# Altium project camera_module_V1R1.PrjPcb
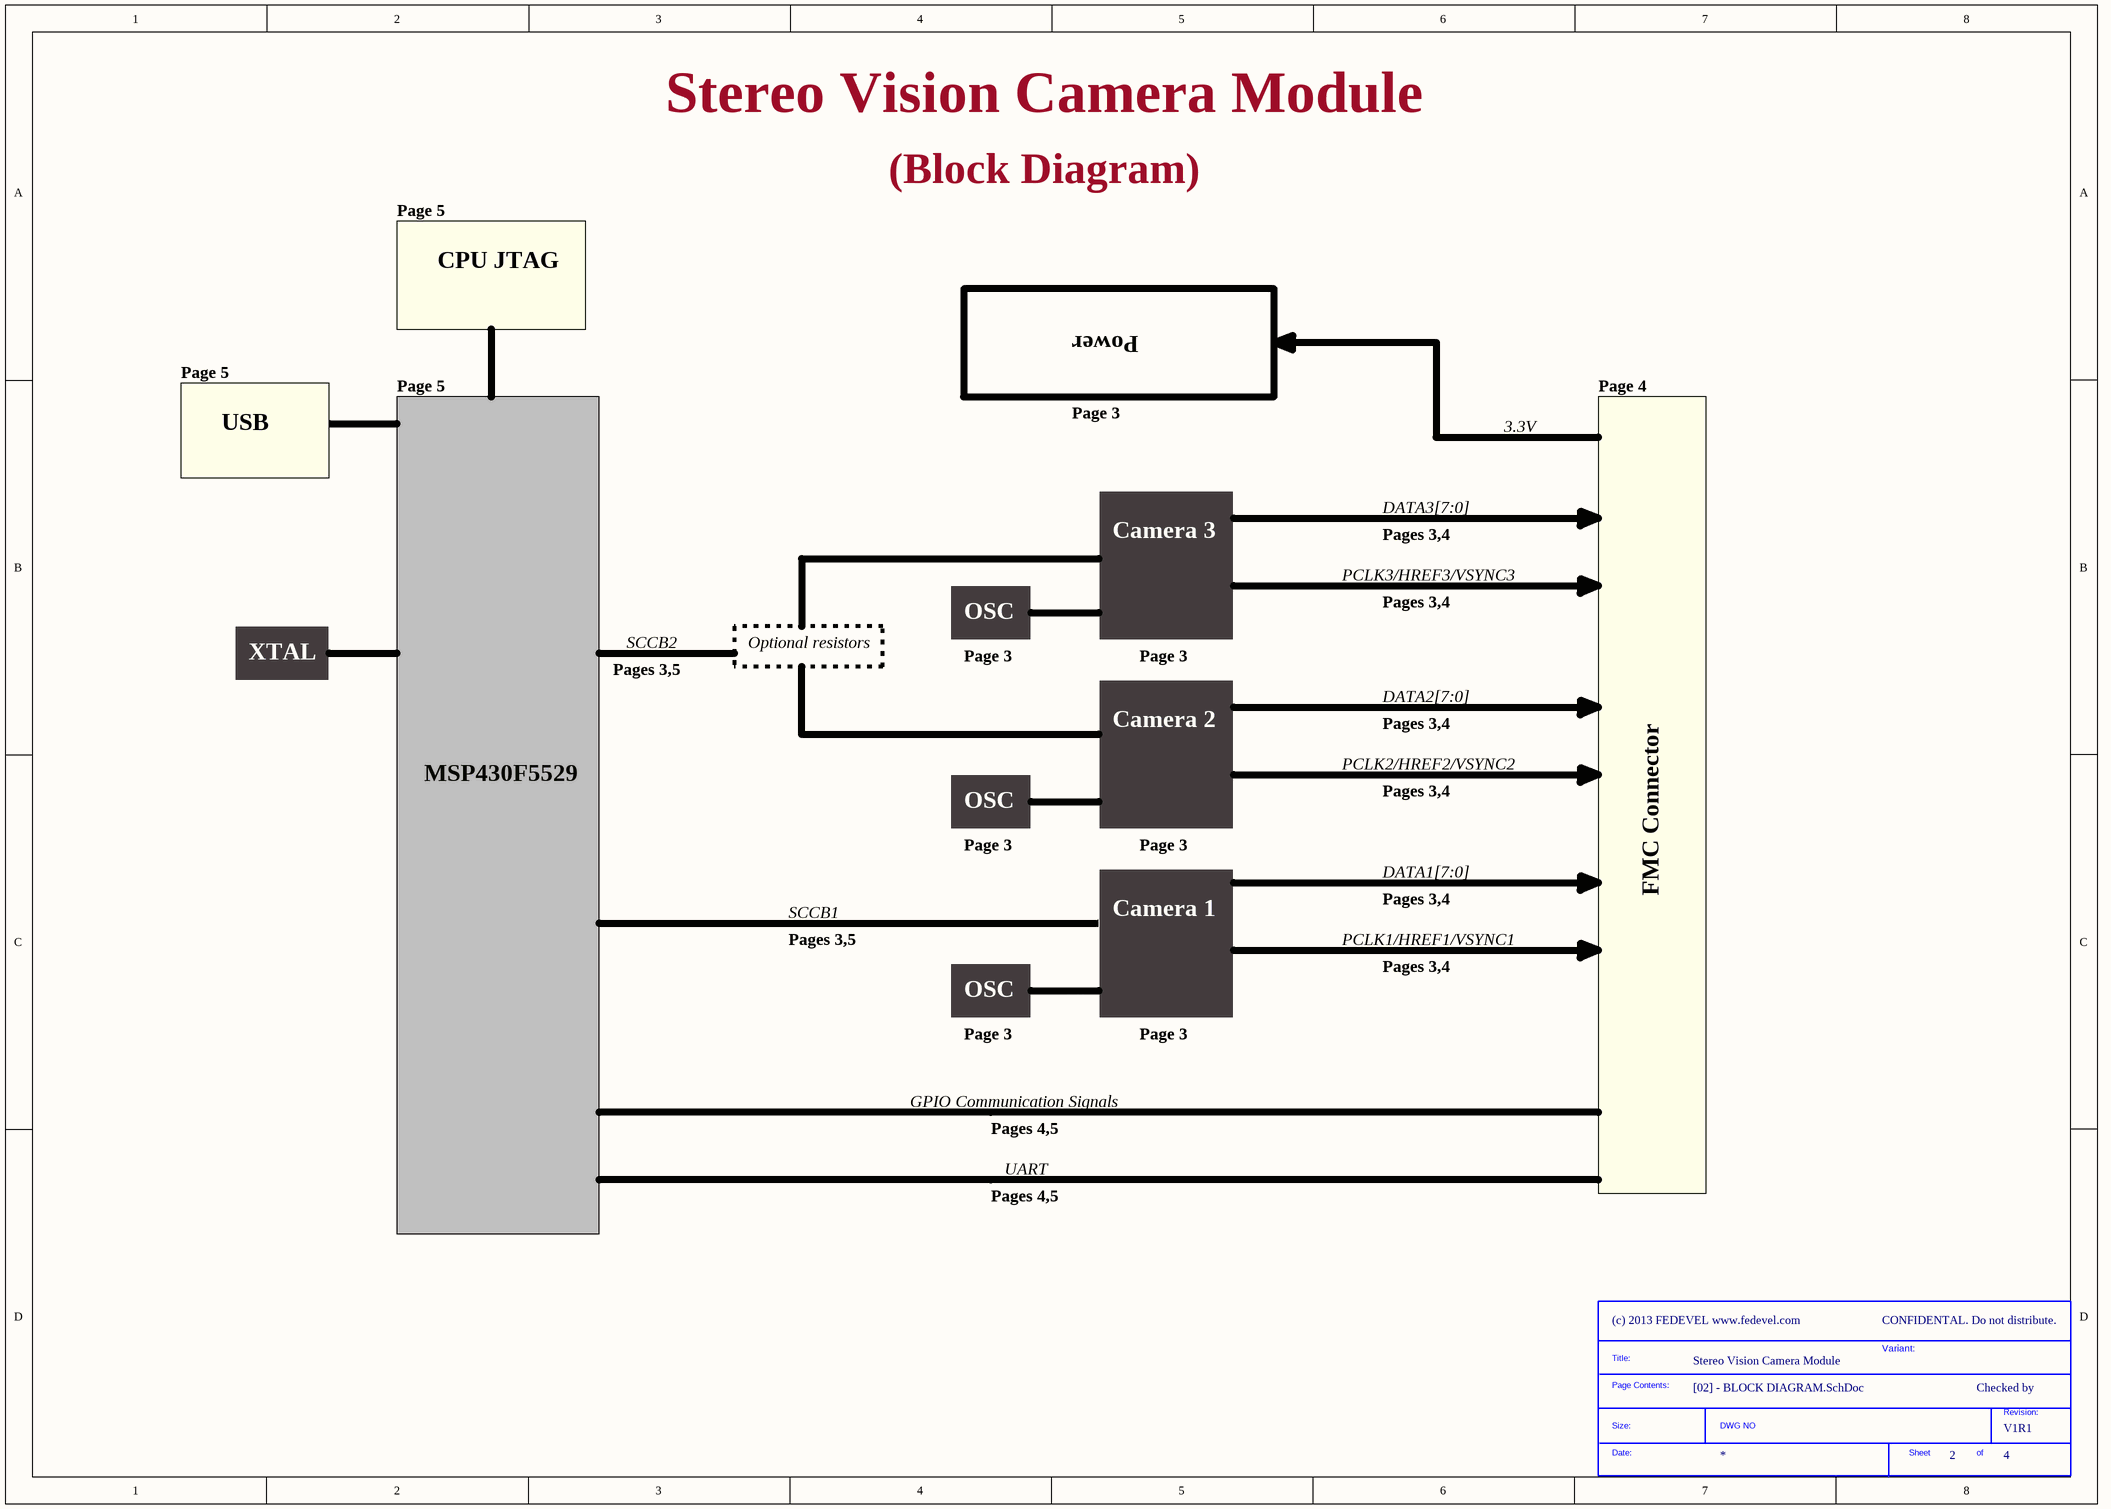
[diagram p0: [02] - BLOCK DIAGRAM.SchDoc]
Company: (c) 2013 FEDEVEL www.fedevel.com; Project: Stereo Vision Camera Module; VersionRevision: V1R1
3 sheets, 65 parts. Net scope: flat (ports and power ports of the same name join across sheets).
Board file: camera_module_PCB_V1R1.PcbDoc
Sheets:
  [02] - BLOCK DIAGRAM.SchDoc
  [04] - Connectors.SchDoc
  [05] - MSP430F5529.SchDoc

## Sheet [02] - BLOCK DIAGRAM.SchDoc
size A3; DocumentNumber: 2; SheetNumber: 2; SheetTotal: 4

### Parts
(Parts that share a designator on the sheet are numbered #1, #2 ... from top to bottom, then left to right.)
*#1  SDTitleBlock  (value not drawn)  (graphical)

### Notes on the sheet
- Page 5
- (Block Diagram)
- CPU JTAG
- Power
- USB
- Page 3
- 3.3V
- Page 4
- DATA3[7:0]
- Camera 3
- PCLK3/HREF3/VSYNC3
- Pages 3,4
- SCCB2
- Optional resistors
- FPGA
- OSC
- ETHERNET
- XTAL
- Pages 3,5
- DATA2[7:0]
- MSP430F5529
- Camera 2
- PCLK2/HREF2/VSYNC2
- SCCB1
- CLOCKS (CPU & PCIE)
- Camera 1
- DATA1[7:0]
- FMC Connector
- PCLK1/HREF1/VSYNC1
- GPIO Communication Signals
- Pages 4,5
- UART
- CONFIDENTAL. Do not distribute.
- Variant:
- Checked by
- (in symbol SDTitleBlock) Title:; Page Contents:; Revision:; Size:; DWG NO; Date:; Sheet; of

## Sheet [04] - Connectors.SchDoc
size A3; DocumentNumber: 2; SheetNumber: 2; SheetTotal: 4
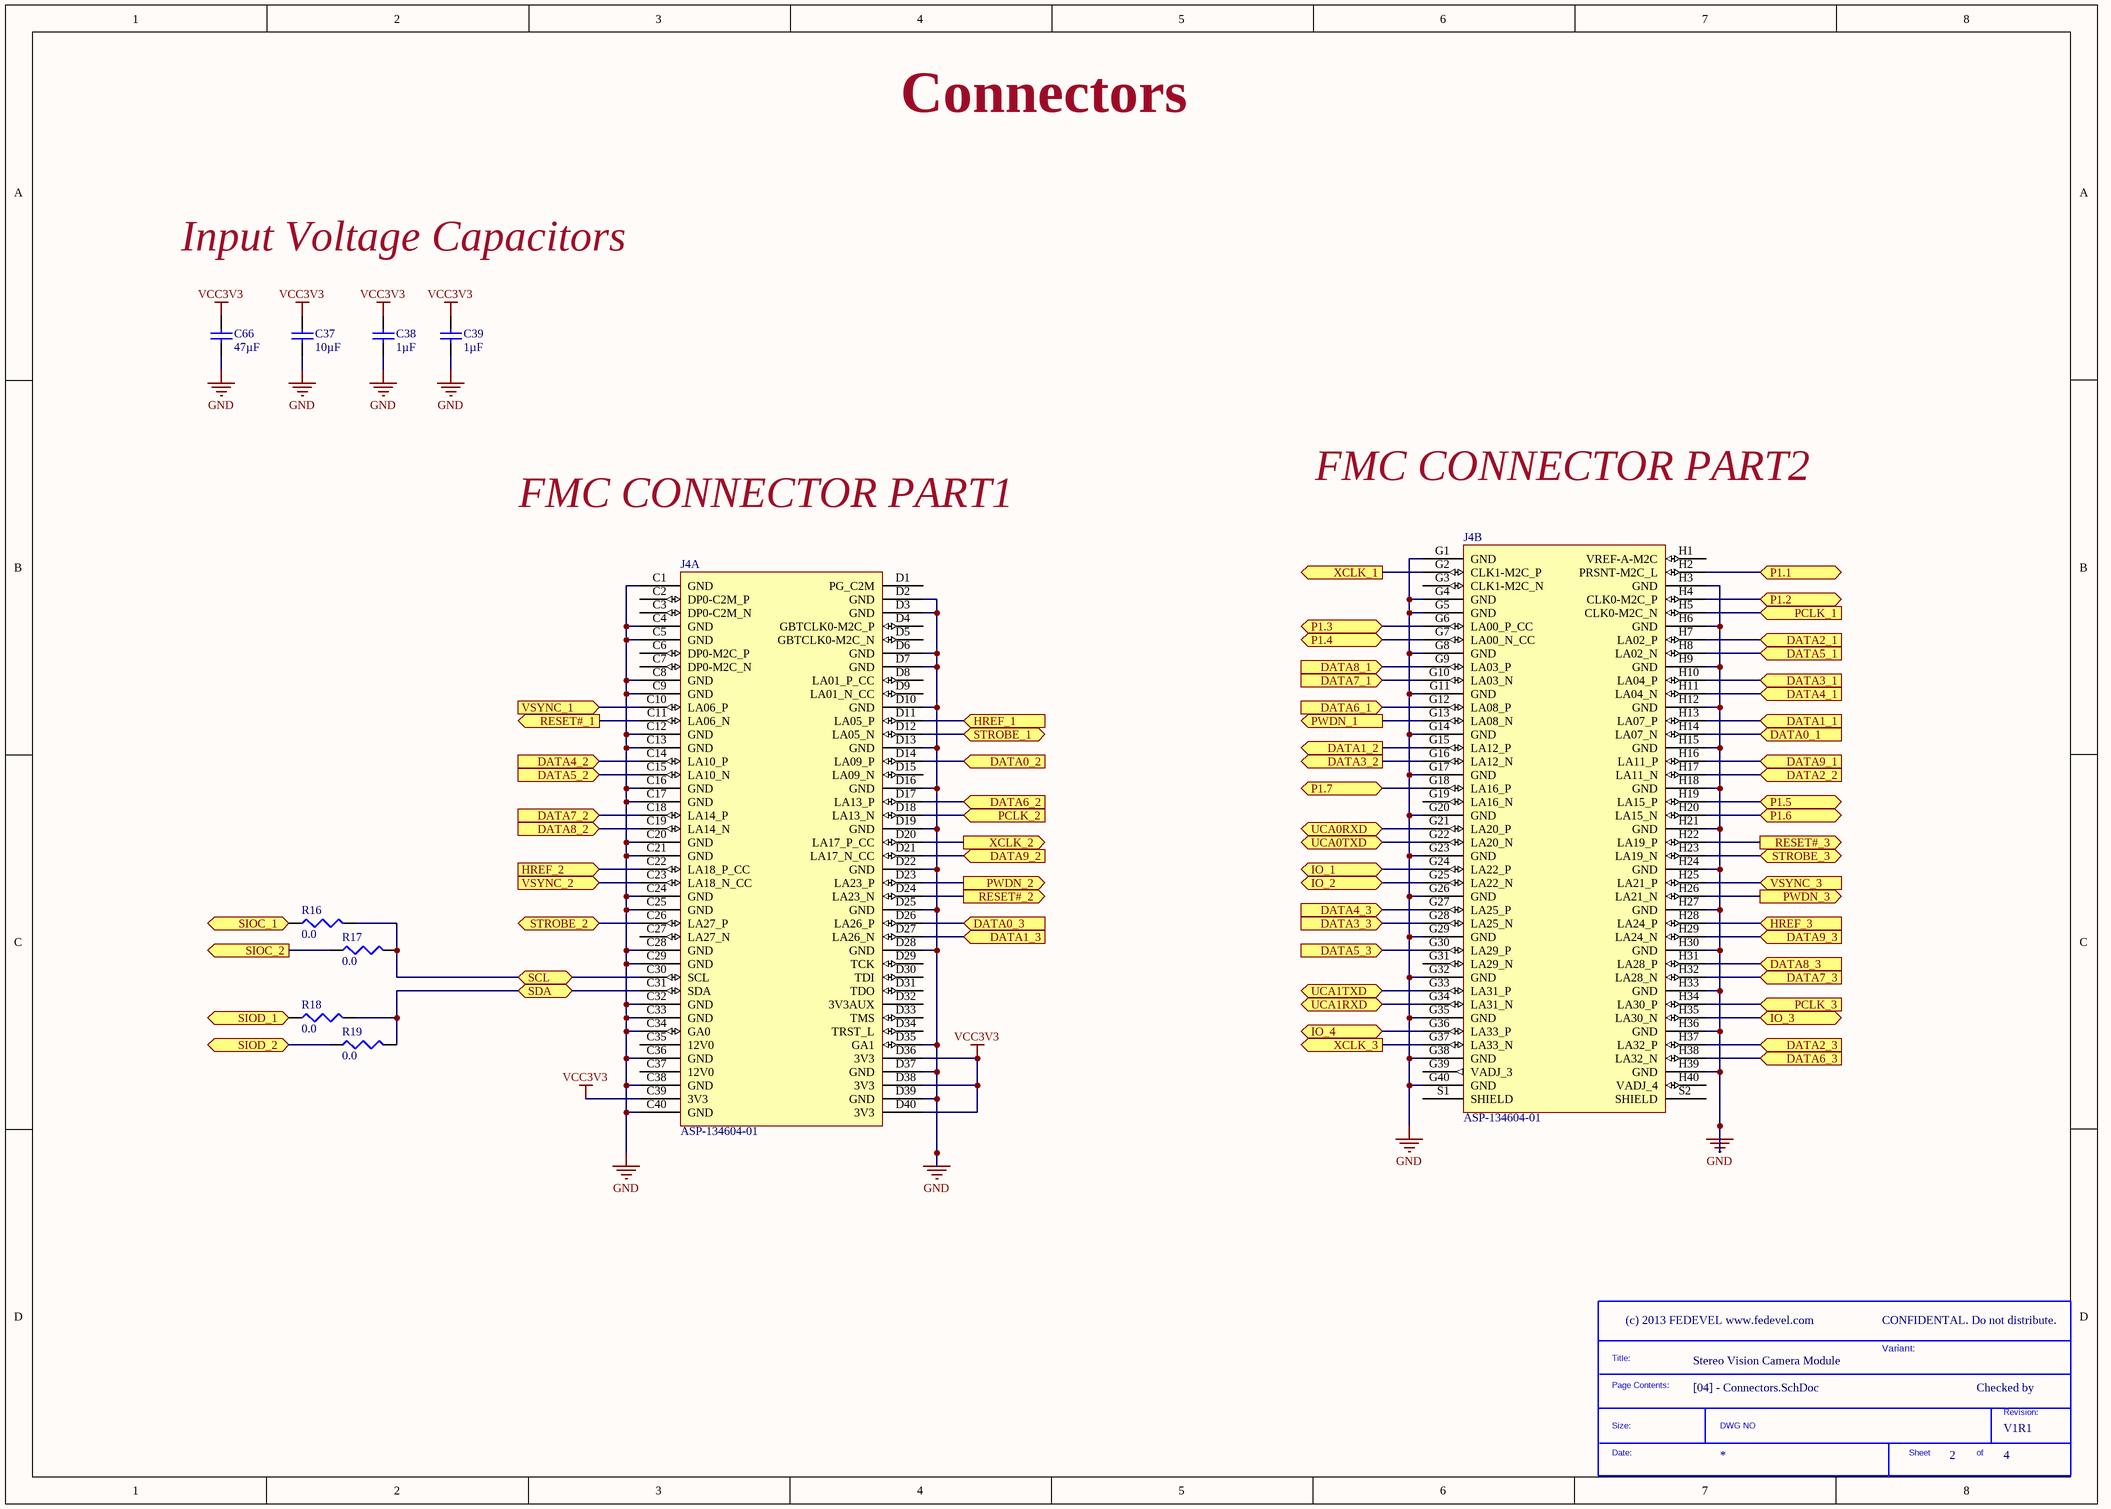
[diagram p1: [04] - Connectors.SchDoc]

### Parts
(Parts that share a designator on the sheet are numbered #1, #2 ... from top to bottom, then left to right.)
*#2  SDTitleBlock  (value not drawn)  (graphical)
C37  Capacitance: 10µF  [CAP-0805]  (hidden comment: GRM21BR61E106KA73L)
C38  Capacitance: 1µF  [CAP-0603]  (hidden comment: GRM188R71C105KA12D)
C39  Capacitance: 1µF  [CAP-0603]  (hidden comment: GRM188R71C105KA12D)
C66  Capacitance: 47µF  [CAP-0805]  (hidden comment: GRM21BR60J476ME15L)
J4  ASP-134604-01  [ASP-134604-01]  (parts A,B of 2)
R16  Resistance (Ohms): 0.0  [R0603]  (hidden comment: ERJ-3GEY0R00V)
R17  Resistance (Ohms): 0.0  [R0603]  (hidden comment: ERJ-3GEY0R00V)
R18  Resistance (Ohms): 0.0  [R0603]  (hidden comment: ERJ-3GEY0R00V)
R19  Resistance (Ohms): 0.0  [R0603]  (hidden comment: ERJ-3GEY0R00V)

### Ports
DATA0_1 (in), DATA0_2 (in), DATA0_3 (in), DATA1_1 (in), DATA1_2 (out), DATA1_3 (in), DATA2_1 (in), DATA2_2 (in), DATA2_3 (in), DATA3_1 (in), DATA3_2 (out), DATA3_3 (in), DATA4_1 (in), DATA4_2 (in), DATA4_3 (in), DATA5_1 (in), DATA5_2 (in), DATA5_3 (in), DATA6_1 (in), DATA6_2 (in), DATA6_3 (in), DATA7_1 (in), DATA7_2 (in), DATA7_3 (in), DATA8_1 (in), DATA8_2 (in), DATA8_3 (in), DATA9_1 (in), DATA9_2 (in), DATA9_3 (in), HREF_1 (in), HREF_2 (in), HREF_3 (in), IO_1 (bidir), IO_2 (bidir), IO_3 (bidir), IO_4 (bidir), P1.1 (bidir), P1.2 (bidir), P1.3 (bidir), P1.4 (bidir), P1.5 (bidir), P1.6 (bidir), P1.7 (bidir), PCLK_1 (in), PCLK_2 (in), PCLK_3 (in), PWDN_1 (out), PWDN_2 (out), PWDN_3 (out), RESET#_1 (out), RESET#_2 (out), RESET#_3 (out), SCL (bidir), SDA (bidir), SIOC_1 (out), SIOC_2 (out), SIOD_1 (bidir), SIOD_2 (bidir), STROBE_1 (bidir), STROBE_2 (bidir), STROBE_3 (bidir), UCA0RXD (bidir), UCA0TXD (bidir), UCA1RXD (bidir), UCA1TXD (bidir), VSYNC_1 (in), VSYNC_2 (in), VSYNC_3 (in), XCLK_1 (out), XCLK_2 (out), XCLK_3 (out)

### Nets
GND: C37.2 C38.2 C39.2 C66.2 J4.C1(GND) J4.C4(GND) J4.C5(GND) J4.C8(GND) J4.C9(GND) J4.C12(GND) J4.C13(GND) J4.C16(GND) J4.C17(GND) J4.C20(GND) J4.C21(GND) J4.C24(GND) J4.C25(GND) J4.C28(GND) J4.C29(GND) J4.C32(GND) J4.C33(GND) J4.C34(GA0) J4.C36(GND) J4.C38(GND) J4.C40(GND) J4.D2(GND) J4.D3(GND) J4.D6(GND) J4.D7(GND) J4.D10(GND) J4.D13(GND) J4.D16(GND) J4.D19(GND) J4.D22(GND) J4.D25(GND) J4.D28(GND) J4.D35(GA1) J4.D37(GND) J4.D39(GND) J4.G1(GND) J4.G4(GND) J4.G5(GND) J4.G8(GND) J4.G11(GND) J4.G14(GND) J4.G17(GND) J4.G20(GND) J4.G23(GND) J4.G26(GND) J4.G29(GND) J4.G32(GND) J4.G35(GND) J4.G38(GND) J4.G40(GND) J4.H3(GND) J4.H6(GND) J4.H9(GND) J4.H12(GND) J4.H15(GND) J4.H18(GND) J4.H21(GND) J4.H24(GND) J4.H27(GND) J4.H30(GND) J4.H33(GND) J4.H36(GND) J4.H39(GND)
VCC3V3: C37.1 C38.1 C39.1 C66.1 J4.C39(3V3) J4.D36(3V3) J4.D38(3V3) J4.D40(3V3)
P1.1: J4.H2(PRSNT-M2C_L) ; port P1.1
P1.2: J4.H4(CLK0-M2C_P) ; port P1.2
P1.3: J4.G6(LA00_P_CC) ; port P1.3
P1.4: J4.G7(LA00_N_CC) ; port P1.4
P1.5: J4.H19(LA15_P) ; port P1.5
P1.6: J4.H20(LA15_N) ; port P1.6
P1.7: J4.G18(LA16_P) ; port P1.7
SIOC_1: R16.1 ; port SIOC_1
SIOC_2: R17.1 ; port SIOC_2
SIOD_1: R18.1 ; port SIOD_1
SIOD_2: R19.1 ; port SIOD_2
UCA0RXD: J4.G21(LA20_P) ; port UCA0RXD
UCA0TXD: J4.G22(LA20_N) ; port UCA0TXD
UCA1RXD: J4.G34(LA31_N) ; port UCA1RXD
UCA1TXD: J4.G33(LA31_P) ; port UCA1TXD
XCLK_1: J4.G2(CLK1-M2C_P) ; port XCLK_1
XCLK_2: J4.D20(LA17_P_CC) ; port XCLK_2
XCLK_3: J4.G37(LA33_N) ; port XCLK_3
NetJ4_C10: J4.C10(LA06_P) ; port VSYNC_1
NetJ4_C11: J4.C11(LA06_N) ; port RESET#_1
NetJ4_C14: J4.C14(LA10_P) ; port DATA4_2
NetJ4_C15: J4.C15(LA10_N) ; port DATA5_2
NetJ4_C18: J4.C18(LA14_P) ; port DATA7_2
NetJ4_C19: J4.C19(LA14_N) ; port DATA8_2
NetJ4_C22: J4.C22(LA18_P_CC) ; port HREF_2
NetJ4_C23: J4.C23(LA18_N_CC) ; port VSYNC_2
NetJ4_C26: J4.C26(LA27_P) ; port STROBE_2
NetJ4_C30: J4.C30(SCL) R16.2 R17.2 ; port SCL
NetJ4_C31: J4.C31(SDA) R18.2 R19.2 ; port SDA
NetJ4_D11: J4.D11(LA05_P) ; port HREF_1
NetJ4_D12: J4.D12(LA05_N) ; port STROBE_1
NetJ4_D14: J4.D14(LA09_P) ; port DATA0_2
NetJ4_D17: J4.D17(LA13_P) ; port DATA6_2
NetJ4_D18: J4.D18(LA13_N) ; port PCLK_2
NetJ4_D21: J4.D21(LA17_N_CC) ; port DATA9_2
NetJ4_D23: J4.D23(LA23_P) ; port PWDN_2
NetJ4_D24: J4.D24(LA23_N) ; port RESET#_2
NetJ4_D26: J4.D26(LA26_P) ; port DATA0_3
NetJ4_D27: J4.D27(LA26_N) ; port DATA1_3
NetJ4_G9: J4.G9(LA03_P) ; port DATA8_1
NetJ4_G10: J4.G10(LA03_N) ; port DATA7_1
NetJ4_G12: J4.G12(LA08_P) ; port DATA6_1
NetJ4_G13: J4.G13(LA08_N) ; port PWDN_1
NetJ4_G15: J4.G15(LA12_P) ; port DATA1_2
NetJ4_G16: J4.G16(LA12_N) ; port DATA3_2
NetJ4_G24: J4.G24(LA22_P) ; port IO_1
NetJ4_G25: J4.G25(LA22_N) ; port IO_2
NetJ4_G27: J4.G27(LA25_P) ; port DATA4_3
NetJ4_G28: J4.G28(LA25_N) ; port DATA3_3
NetJ4_G30: J4.G30(LA29_P) ; port DATA5_3
NetJ4_G36: J4.G36(LA33_P) ; port IO_4
NetJ4_H5: J4.H5(CLK0-M2C_N) ; port PCLK_1
NetJ4_H7: J4.H7(LA02_P) ; port DATA2_1
NetJ4_H8: J4.H8(LA02_N) ; port DATA5_1
NetJ4_H10: J4.H10(LA04_P) ; port DATA3_1
NetJ4_H11: J4.H11(LA04_N) ; port DATA4_1
NetJ4_H13: J4.H13(LA07_P) ; port DATA1_1
NetJ4_H14: J4.H14(LA07_N) ; port DATA0_1
NetJ4_H16: J4.H16(LA11_P) ; port DATA9_1
NetJ4_H17: J4.H17(LA11_N) ; port DATA2_2
NetJ4_H22: J4.H22(LA19_P) ; port RESET#_3
NetJ4_H23: J4.H23(LA19_N) ; port STROBE_3
NetJ4_H25: J4.H25(LA21_P) ; port VSYNC_3
NetJ4_H26: J4.H26(LA21_N) ; port PWDN_3
NetJ4_H28: J4.H28(LA24_P) ; port HREF_3
NetJ4_H29: J4.H29(LA24_N) ; port DATA9_3
NetJ4_H31: J4.H31(LA28_P) ; port DATA8_3
NetJ4_H32: J4.H32(LA28_N) ; port DATA7_3
NetJ4_H34: J4.H34(LA30_P) ; port PCLK_3
NetJ4_H35: J4.H35(LA30_N) ; port IO_3
NetJ4_H37: J4.H37(LA32_P) ; port DATA2_3
NetJ4_H38: J4.H38(LA32_N) ; port DATA6_3

Not connected (* = marked no-connect by the designer): J4 C2(DP0-C2M_P) C3(DP0-C2M_N) C6(DP0-M2C_P) C7(DP0-M2C_N) C27(LA27_N) C35(12V0) C37(12V0) D1(PG_C2M) D4(GBTCLK0-M2C_P) D5(GBTCLK0-M2C_N) D8(LA01_P_CC) D9(LA01_N_CC) D15(LA09_N) D29(TCK) D30(TDI) D31(TDO) D32(3V3AUX) D33(TMS) D34(TRST_L) G3(CLK1-M2C_N) G19(LA16_N) G31(LA29_N) G39(VADJ_3) H1(VREF-A-M2C) H40(VADJ_4) S1(SHIELD) S2(SHIELD)

### Notes on the sheet
- Connectors
- Input Voltage Capacitors
- FMC CONNECTOR PART1
- FMC CONNECTOR PART2
- CONFIDENTAL. Do not distribute.
- Variant:
- Checked by
- (in symbol SDTitleBlock) Title:; Page Contents:; Revision:; Size:; DWG NO; Date:; Sheet; of

### Library data of the parts
C37 = GRM21BR61E106KA73L: CAP CER 10UF 25V X5R 0805; Manufacturer: Murata Electronics North America; Tolerance: ±10%; Supplier 1: Digi-Key; Manufacturer Part Number: GRM21BR61E106KA73L; RoHS: RoHS Compliant; Category: Capacitors; Stock 1: 242003; Pricing 1: 1=0.2, 10=0.136, 50=0.0826, 100=0.0693 (USD); Packaging: Cut Tape (CT); Voltage - Rated: 25V; Temperature Coefficient: X5R; Mounting Type: Surface Mount, MLCC; Operating Temperature: -55°C ~ 85°C; Applications: General Purpose; Ratings: -; Package / Case: 0805 (2012 Metric); Size / Dimension: 0.079" L x 0.049" W (2.00mm x 1.25mm); Height - Seated (Max): -; Thickness (Max): 0.053" (1.35mm); Lead Spacing: -; Features: -; Lead Style: -; ComponentLink1URL: http://www.murata.com/~/media/webrenewal/support/library/catalog/products/capacitor/mlcc/c02e.pdf; ComponentLink1Description: http://www.murata.com/~/media/webrenewal/support/library/catalog/products/capacitor/mlcc/c02e.pdf; Supplier Part Number 1: 490-5523-1-ND
C38 C39 = GRM188R71C105KA12D: CAP CER 1UF 16V X7R 0603; Manufacturer: Murata Electronics North America; Tolerance: ±10%; Supplier 1: Digi-Key; Manufacturer Part Number: GRM188R71C105KA12D; RoHS: RoHS Compliant; Category: Capacitors; Stock 1: 819049; Pricing 1: 1=0.1, 10=0.073, 50=0.0396, 100=0.0336, 250=0.02744, 500=0.02348, 1000=0.0183 (USD); Packaging: Cut Tape (CT); Voltage - Rated: 16V; Temperature Coefficient: X7R; Mounting Type: Surface Mount, MLCC; Operating Temperature: -55°C ~ 125°C; Applications: General Purpose; Ratings: -; Package / Case: 0603 (1608 Metric); Size / Dimension: 0.063" L x 0.031" W (1.60mm x 0.80mm); Height - Seated (Max): -; Thickness (Max): 0.035" (0.90mm); Lead Spacing: -; Features: -; Lead Style: -; ComponentLink1URL: http://www.murata.com/~/media/webrenewal/support/library/catalog/products/capacitor/mlcc/c02e.pdf; ComponentLink1Description: http://www.murata.com/~/media/webrenewal/support/library/catalog/products/capacitor/mlcc/c02e.pdf; Supplier Part Number 1: 490-3900-1-ND
C66 = GRM21BR60J476ME15L: CAP CER 47UF 6.3V X5R 0805; Manufacturer: Murata Electronics North America; Tolerance: ±20%; Supplier 1: Digi-Key; Manufacturer Part Number: GRM21BR60J476ME15L; RoHS: RoHS Compliant; Category: Capacitors; Stock 1: 2019; Pricing 1: 1=0.5, 10=0.48, 50=0.2864, 100=0.2327, 250=0.19332, 500=0.17542, 1000=0.1611 (USD); Packaging: Cut Tape (CT); Voltage - Rated: 6.3V; Temperature Coefficient: X5R; Mounting Type: Surface Mount, MLCC; Operating Temperature: -55°C ~ 85°C; Applications: General Purpose; Ratings: -; Package / Case: 0805 (2012 Metric); Size / Dimension: 0.079" L x 0.049" W (2.00mm x 1.25mm); Height - Seated (Max): -; Thickness (Max): 0.057" (1.45mm); Lead Spacing: -; Features: Derating Recommended; Lead Style: -; ComponentLink1URL: http://www.murata.com/~/media/webrenewal/support/library/catalog/products/capacitor/mlcc/c02e.pdf; ComponentLink1Description: http://www.murata.com/~/media/webrenewal/support/library/catalog/products/capacitor/mlcc/c02e.pdf; Supplier Part Number 1: 490-9960-1-ND
J4 = ASP-134604-01: SAMTEC - ASP-134604-01 - Board-To-Board Connector, Vita 57 XMC, ASP Series, Surface Mount, Header, 160, 1.27 mm; Supplier 1: Newark; Manufacturer: SAMTEC; Manufacturer Part Number: ASP-134604-01; RoHS: YES; Stock 1: 636; Pricing 1: 1=16.5, 10=15.6, 50=14.28, 100=12.96, 250=12.3, 500=11.72, 1000=11.55 (USD); ComponentLink1URL: http://www.farnell.com/cad/1838626.pdf; ComponentLink1Description: http://www.farnell.com/cad/1838626.pdf; Supplier Part Number 1: 79X1317
R16-R19 = ERJ-3GEY0R00V: RES SMD 0.0OHM JUMPER 1/10W 0603; Manufacturer: Panasonic Electronic Components; Power (Watts): 0.1W, 1/10W; Supplier 1: Digi-Key; Manufacturer Part Number: ERJ-3GEY0R00V; RoHS: RoHS Compliant; Category: Resistors; Stock 1: 7608993; Pricing 1: 1=0.1, 50=0.0126, 100=0.0096, 250=0.00716, 500=0.00528, 1000=0.00352, 2500=0.00297 (USD); Packaging: Cut Tape (CT); Tolerance: Jumper; Composition: Thick Film; Features: Automotive AEC-Q200; Temperature Coefficient: -; Operating Temperature: -55°C ~ 155°C; Package / Case: 0603 (1608 Metric); Supplier Device Package: 0603; Size / Dimension: 0.063" L x 0.031" W (1.60mm x 0.80mm); Height: 0.022" (0.55mm); Number of Terminations: 2; ComponentLink1URL: http://industrial.panasonic.com/www-cgi/jvcr13pz.cgi?E+PZ+3+AOA0001+ERJ3GEY0R00V+7+WW; ComponentLink1Description: http://industrial.panasonic.com/www-cgi/jvcr13pz.cgi?E+PZ+3+AOA0001+ERJ3GEY0R00V+7+WW; Supplier Part Number 1: P0.0GCT-ND

## Sheet [05] - MSP430F5529.SchDoc
size A3; DocumentNumber: 2; SheetNumber: 2; SheetTotal: 4
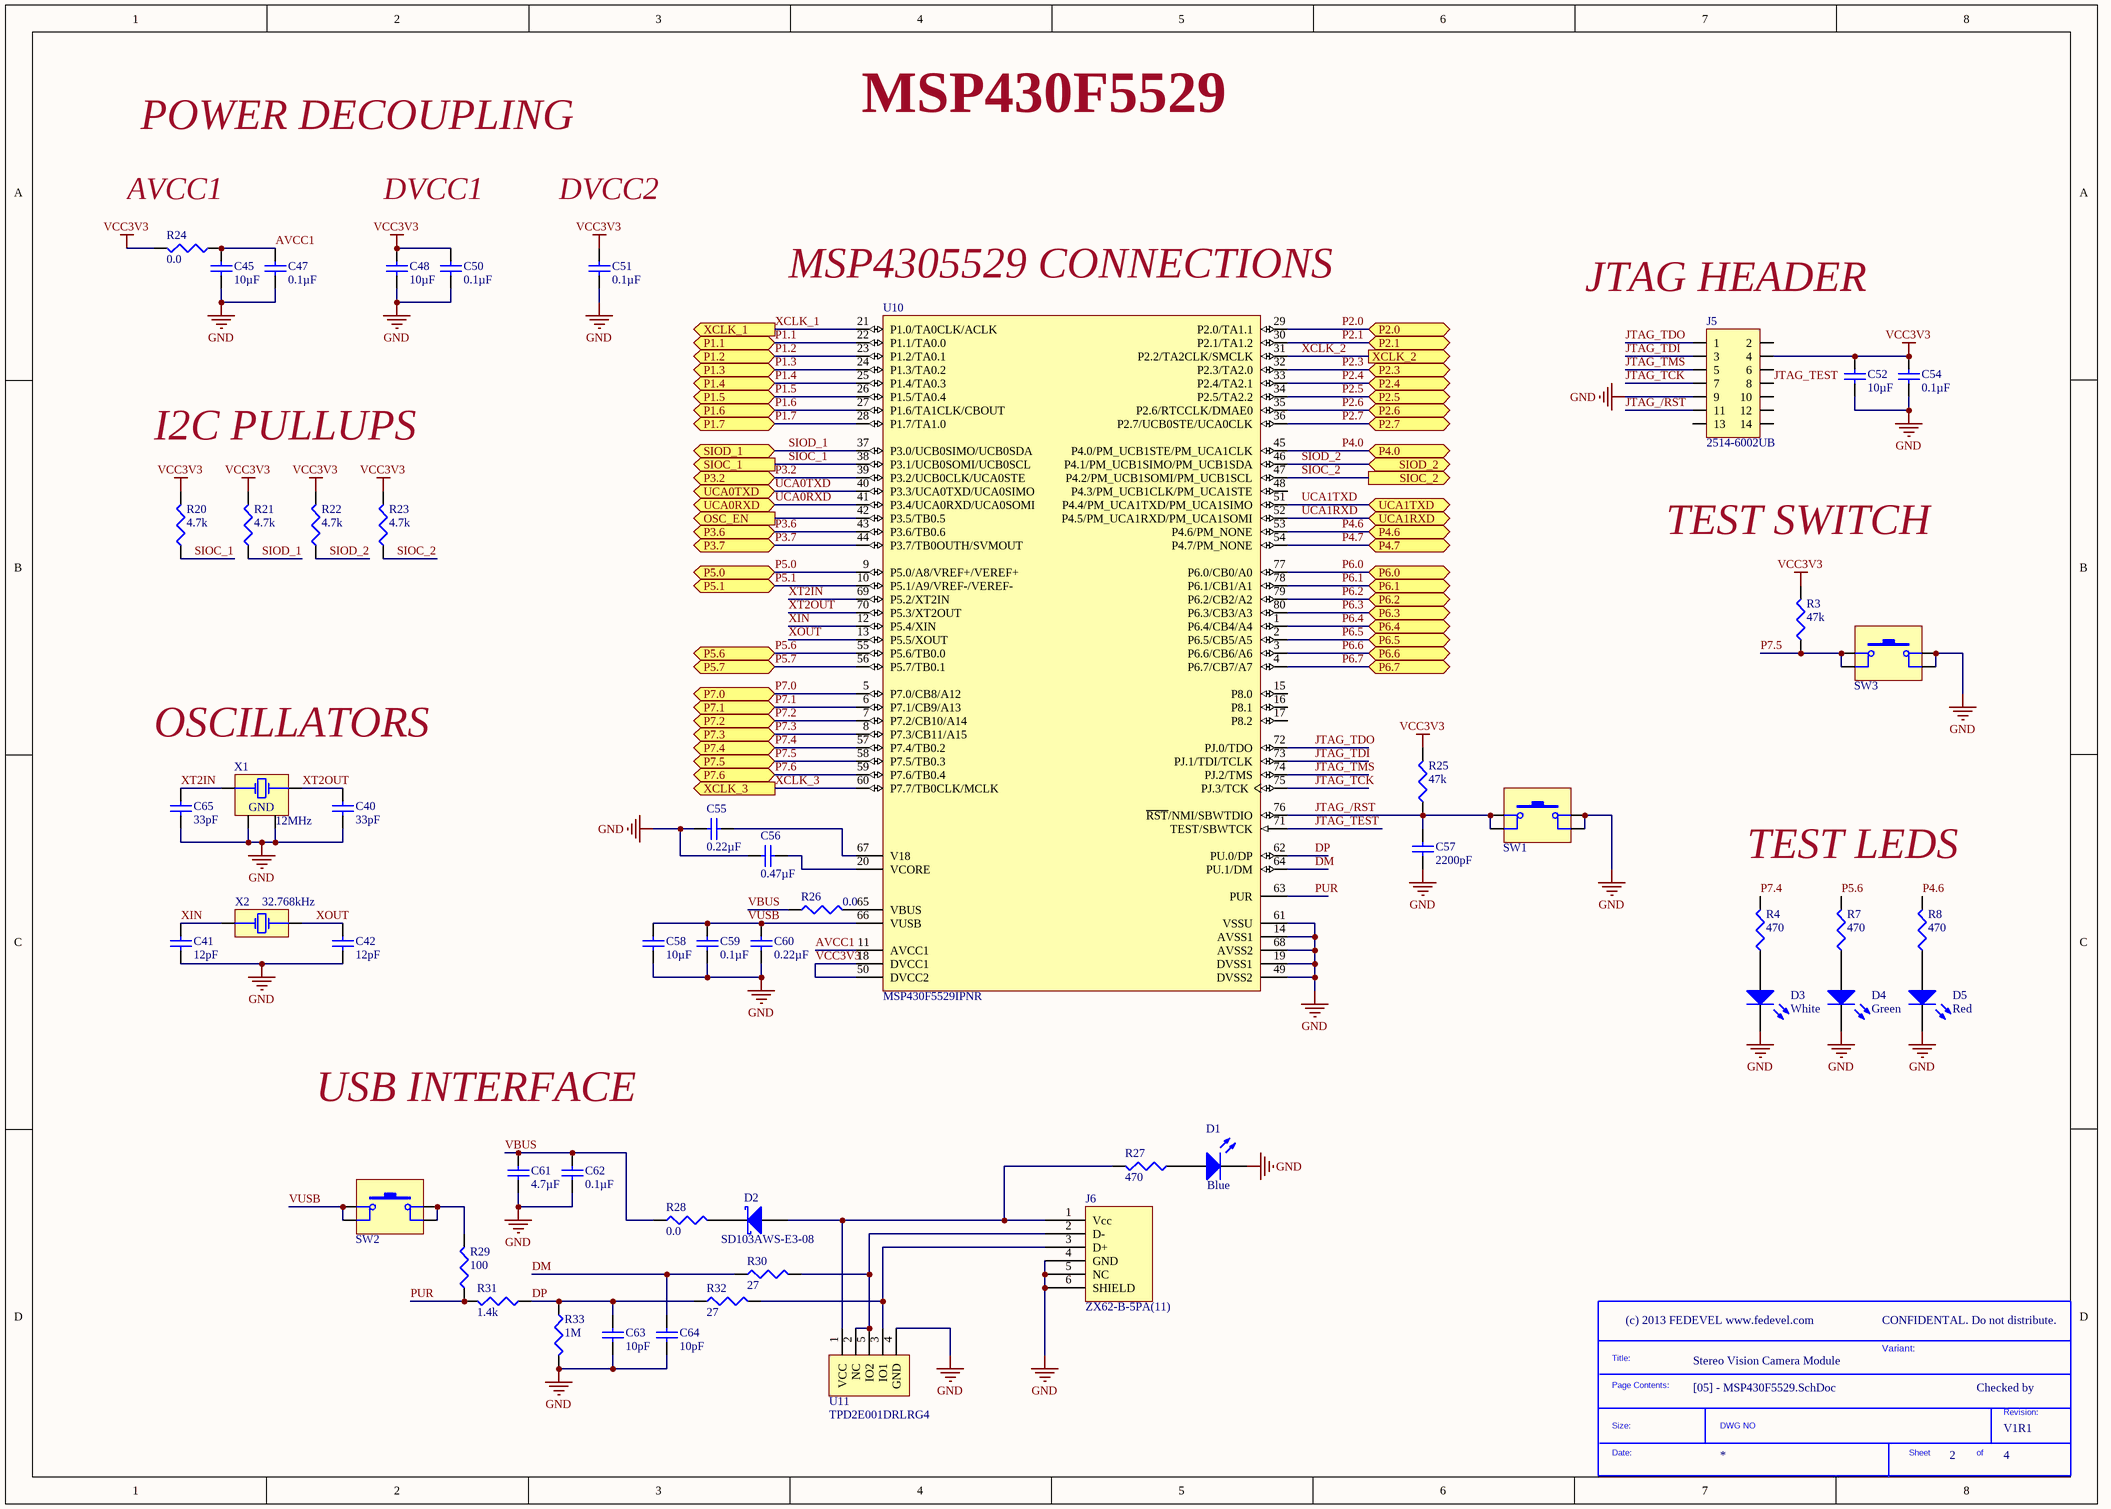
[diagram p2: [05] - MSP430F5529.SchDoc]

### Parts
(Parts that share a designator on the sheet are numbered #1, #2 ... from top to bottom, then left to right.)
*#3  SDTitleBlock  (value not drawn)  (graphical)
C40  Capacitance: 33pF  [CAP-0603]  (hidden comment: C1608C0G1H330J080AA)
C41  Capacitance: 12pF  [CAP-0603]  (hidden comment: C1608C0G1H120J080AA)
C42  Capacitance: 12pF  [CAP-0603]  (hidden comment: C1608C0G1H120J080AA)
C45  Capacitance: 10µF  [CAP-0805]  (hidden comment: GRM21BR61E106KA73L)
C47  Capacitance: 0.1µF  [CAP-0603]  (hidden comment: GRM188R71C104KA01D)
C48  Capacitance: 10µF  [CAP-0805]  (hidden comment: GRM21BR61E106KA73L)
C50  Capacitance: 0.1µF  [CAP-0603]  (hidden comment: GRM188R71C104KA01D)
C51  Capacitance: 0.1µF  [CAP-0603]  (hidden comment: GRM188R71C104KA01D)
C52  Capacitance: 10µF  [CAP-0805]  (hidden comment: GRM21BR61E106KA73L)
C54  Capacitance: 0.1µF  [CAP-0603]  (hidden comment: GRM188R71C104KA01D)
C55  Capacitance: 0.22µF  [CAP-0603]  (hidden comment: GRM188R71C224KA01D)
C56  Capacitance: 0.47µF  [CAP-0603]  (hidden comment: C1608X5R1C474K080AA)
C57  Capacitance: 2200pF  [CAP-0603]  (hidden comment: GRM188R71C222KA01D)
C58  Capacitance: 10µF  [CAP-0805]  (hidden comment: GRM21BR61E106KA73L)
C59  Capacitance: 0.1µF  [CAP-0603]  (hidden comment: GRM188R71C104KA01D)
C60  Capacitance: 0.22µF  [CAP-0603]  (hidden comment: GRM188R71C224KA01D)
C61  Capacitance: 4.7µF  [CAP-0603]  (hidden comment: GRM188R60J475KE19D)
C62  Capacitance: 0.1µF  [CAP-0603]  (hidden comment: GRM188R71C104KA01D)
C63  Capacitance: 10pF  [CAP-0603]  (hidden comment: GRM1885C1H100JA01D)
C64  Capacitance: 10pF  [CAP-0603]  (hidden comment: GRM1885C1H100JA01D)
C65  Capacitance: 33pF  [CAP-0603]  (hidden comment: C1608C0G1H330J080AA)
D1  Color: Blue  [LED_0603]  (hidden comment: LB Q39E-N1OO-35-1)
D2  SD103AWS-E3-08  [SOD-323]
D3  Color: White  [LED_0603]  (hidden comment: SMLE12WBC7W1)
D4  Color: Green  [LED_0603]  (hidden comment: SML-D12M8WT86)
D5  Color: Red  [LED_0603]  (hidden comment: SML-D12U8WT86)
J5  2514-6002UB  [2514-6002UB]
J6  ZX62-B-5PA(11)  [micro-USB]
R3  Resistance (Ohms): 47k  [CAP-0603]  (hidden comment: Panasonic Electronic Components)
R4  Resistance (Ohms): 470  [R0603]  (hidden comment: ERJ-3EKF4700V)
R7  Resistance (Ohms): 470  [R0603]  (hidden comment: ERJ-3EKF4700V)
R8  Resistance (Ohms): 470  [R0603]  (hidden comment: ERJ-3EKF4700V)
R20  Resistance (Ohms): 4.7k  [R0603]  (hidden comment: ERJ-3EKF4701V)
R21  Resistance (Ohms): 4.7k  [R0603]  (hidden comment: ERJ-3EKF4701V)
R22  Resistance (Ohms): 4.7k  [R0603]  (hidden comment: ERJ-3EKF4701V)
R23  Resistance (Ohms): 4.7k  [R0603]  (hidden comment: ERJ-3EKF4701V)
R24  Resistance (Ohms): 0.0  [R0603]  (hidden comment: ERJ-3GEY0R00V)
R25  Resistance (Ohms): 47k  [CAP-0603]  (hidden comment: Panasonic Electronic Components)
R26  Resistance (Ohms): 0.0  [R0603]  (hidden comment: ERJ-3GEY0R00V)
R27  Resistance (Ohms): 470  [R0603]  (hidden comment: ERJ-3EKF4700V)
R28  Resistance (Ohms): 0.0  [R0603]  (hidden comment: ERJ-3GEY0R00V)
R29  Resistance (Ohms): 100  [R0603]  (hidden comment: ERJ-3EKF1000V)
R30  Resistance (Ohms): 27  [R0603]  (hidden comment: ERJ-3EKF27R0V)
R31  Resistance (Ohms): 1.4k  [R0603]  (hidden comment: ERJ-3EKF1401V)
R32  Resistance (Ohms): 27  [R0603]  (hidden comment: ERJ-3EKF27R0V)
R33  Resistance (Ohms): 1M  [R0603]  (hidden comment: ERJ-3EKF1004V)
SW1  PTS645SH50SMTR92 LFS  [Tactile Switch]  (value not drawn)
SW2  PTS645SH50SMTR92 LFS  [Tactile Switch]  (value not drawn)
SW3  PTS645SH50SMTR92 LFS  [Tactile Switch]  (value not drawn)
U10  MSP430F5529IPNR  [TI-PN80_N]
U11  TPD2E001DRLRG4  [DRL]
X1  12MHz  [XTAL-4SMD 5x3.20]
X2  32.768kHz  [2-SMD_xtal]

### Ports
OSC_EN (out), P1.1 (bidir), P1.2 (bidir), P1.3 (bidir), P1.4 (bidir), P1.5 (bidir), P1.6 (bidir), P1.7 (bidir), P2.0 (bidir), P2.1 (bidir), P2.3 (bidir), P2.4 (bidir), P2.5 (bidir), P2.6 (bidir), P2.7 (bidir), P3.2 (bidir), P3.6 (bidir), P3.7 (bidir), P4.0 (bidir), P4.6 (bidir), P4.7 (bidir), P5.0 (bidir), P5.1 (bidir), P5.6 (bidir), P5.7 (bidir), P6.0 (bidir), P6.1 (bidir), P6.2 (bidir), P6.3 (bidir), P6.4 (bidir), P6.5 (bidir), P6.6 (bidir), P6.7 (bidir), P7.0 (bidir), P7.1 (bidir), P7.2 (bidir), P7.3 (bidir), P7.4 (bidir), P7.5 (bidir), P7.6 (bidir), SIOC_1 (out), SIOC_2 (out), SIOD_1 (bidir), SIOD_2 (bidir), UCA0RXD (bidir), UCA0TXD (bidir), UCA1RXD (bidir), UCA1TXD (bidir), XCLK_1 (out), XCLK_2 (out), XCLK_3 (out)

### Nets
GND: C40.2 C41.2 C42.2 C45.2 C47.2 C48.2 C50.2 C51.2 C52.2 C54.2 C55.2 C56.2 C57.2 C58.1 C59.1 C60.2 C61.2 C62.2 C63.2 C64.2 C65.2 D1.2(K) D3.2(K) D4.2(K) D5.2(K) J5.9 J6.4(GND) J6.5(NC) J6.6(SHIELD) R33.2 SW1.3 SW1.4 SW3.3 SW3.4 U10.14(AVSS1) U10.19(DVSS1) U10.49(DVSS2) U10.61(VSSU) U10.68(AVSS2) U11.4(GND) X1.2(GND) X1.4(GND)
VCC3V3: C48.1 C50.1 C51.1 C52.1 C54.1 J5.4 R3.2 R20.2 R21.2 R22.2 R23.2 R24.2 R25.2 U10.18(DVCC1) U10.50(DVCC2)
AVCC1: C45.1 C47.1 R24.1 U10.11(AVCC1)
DM: C64.1 R30.1 U10.64(PU.1/DM)
DP: C63.1 R31.1 R32.1 R33.1 U10.62(PU.0/DP)
JTAG_/RST: C57.1 J5.11 R25.1 SW1.1 SW1.2 U10.76(~{RST}/NMI/SBWTDIO)
JTAG_TCK: J5.7 U10.75(PJ.3/TCK)
JTAG_TDI: J5.3 U10.73(PJ.1/TDI/TCLK)
JTAG_TDO: J5.1 U10.72(PJ.0/TDO)
JTAG_TEST: J5.8 U10.71(TEST/SBWTCK)
JTAG_TMS: J5.5 U10.74(PJ.2/TMS)
P1.1: U10.22(P1.1/TA0.0) ; port P1.1
P1.2: U10.23(P1.2/TA0.1) ; port P1.2
P1.3: U10.24(P1.3/TA0.2) ; port P1.3
P1.4: U10.25(P1.4/TA0.3) ; port P1.4
P1.5: U10.26(P1.5/TA0.4) ; port P1.5
P1.6: U10.27(P1.6/TA1CLK/CBOUT) ; port P1.6
P1.7: U10.28(P1.7/TA1.0) ; port P1.7
P2.0: U10.29(P2.0/TA1.1) ; port P2.0
P2.1: U10.30(P2.1/TA1.2) ; port P2.1
P2.3: U10.32(P2.3/TA2.0) ; port P2.3
P2.4: U10.33(P2.4/TA2.1) ; port P2.4
P2.5: U10.34(P2.5/TA2.2) ; port P2.5
P2.6: U10.35(P2.6/RTCCLK/DMAE0) ; port P2.6
P2.7: U10.36(P2.7/UCB0STE/UCA0CLK) ; port P2.7
P3.2: U10.39(P3.2/UCB0CLK/UCA0STE) ; port P3.2
P3.6: U10.43(P3.6/TB0.6) ; port P3.6
P3.7: U10.44(P3.7/TB0OUTH/SVMOUT) ; port P3.7
P4.0: U10.45(P4.0/PM_UCB1STE/PM_UCA1CLK) ; port P4.0
P4.6: R8.2 U10.53(P4.6/PM_NONE) ; port P4.6
P4.7: U10.54(P4.7/PM_NONE) ; port P4.7
P5.0: U10.9(P5.0/A8/VREF+/VEREF+) ; port P5.0
P5.1: U10.10(P5.1/A9/VREF-/VEREF-) ; port P5.1
P5.6: R7.2 U10.55(P5.6/TB0.0) ; port P5.6
P5.7: U10.56(P5.7/TB0.1) ; port P5.7
P6.0: U10.77(P6.0/CB0/A0) ; port P6.0
P6.1: U10.78(P6.1/CB1/A1) ; port P6.1
P6.2: U10.79(P6.2/CB2/A2) ; port P6.2
P6.3: U10.80(P6.3/CB3/A3) ; port P6.3
P6.4: U10.1(P6.4/CB4/A4) ; port P6.4
P6.5: U10.2(P6.5/CB5/A5) ; port P6.5
P6.6: U10.3(P6.6/CB6/A6) ; port P6.6
P6.7: U10.4(P6.7/CB7/A7) ; port P6.7
P7.0: U10.5(P7.0/CB8/A12) ; port P7.0
P7.1: U10.6(P7.1/CB9/A13) ; port P7.1
P7.2: U10.7(P7.2/CB10/A14) ; port P7.2
P7.3: U10.8(P7.3/CB11/A15) ; port P7.3
P7.4: R4.2 U10.57(P7.4/TB0.2) ; port P7.4
P7.5: R3.1 SW3.1 SW3.2 U10.58(P7.5/TB0.3) ; port P7.5
P7.6: U10.59(P7.6/TB0.4) ; port P7.6
PUR: R29.1 R31.2 U10.63(PUR)
SIOC_1: R20.1 U10.38(P3.1/UCB0SOMI/UCB0SCL) ; port SIOC_1
SIOC_2: R23.1 U10.47(P4.2/PM_UCB1SOMI/PM_UCB1SCL) ; port SIOC_2
SIOD_1: R21.1 U10.37(P3.0/UCB0SIMO/UCB0SDA) ; port SIOD_1
SIOD_2: R22.1 U10.46(P4.1/PM_UCB1SIMO/PM_UCB1SDA) ; port SIOD_2
UCA0RXD: U10.41(P3.4/UCA0RXD/UCA0SOMI) ; port UCA0RXD
UCA0TXD: U10.40(P3.3/UCA0TXD/UCA0SIMO) ; port UCA0TXD
UCA1RXD: U10.52(P4.5/PM_UCA1RXD/PM_UCA1SOMI) ; port UCA1RXD
UCA1TXD: U10.51(P4.4/PM_UCA1TXD/PM_UCA1SIMO) ; port UCA1TXD
VBUS: C61.1 C62.1 R26.1 R28.1
VUSB: C58.2 C59.2 C60.1 SW2.1 SW2.2 U10.66(VUSB)
XCLK_1: U10.21(P1.0/TA0CLK/ACLK) ; port XCLK_1
XCLK_2: U10.31(P2.2/TA2CLK/SMCLK) ; port XCLK_2
XCLK_3: U10.60(P7.7/TB0CLK/MCLK) ; port XCLK_3
XIN: C41.1 U10.12(P5.4/XIN) X2.2(OSC2)
XOUT: C42.1 U10.13(P5.5/XOUT) X2.1(OSC1)
XT2IN: C65.1 U10.69(P5.2/XT2IN) X1.1(OSC1)
XT2OUT: C40.1 U10.70(P5.3/XT2OUT) X1.3(OSC2)
NetC55_1: C55.1 U10.67(V18)
NetC56_1: C56.1 U10.20(VCORE)
NetD1_1: D1.1(A) R27.1
NetD2_1: D2.1(K) R28.2
NetD2_3: D2.3(A) J6.1(Vcc) R27.2 U11.1(VCC)
NetD3_1: D3.1(A) R4.1
NetD4_1: D4.1(A) R7.1
NetD5_1: D5.1(A) R8.1
NetJ6_2: J6.2(D-) R30.2 U11.2(NC) U11.5(IO2)
NetJ6_3: J6.3(D+) R32.2 U11.3(IO1)
NetR26_2: R26.2 U10.65(VBUS)
NetR29_2: R29.2 SW2.3 SW2.4
NetU10_42: U10.42(P3.5/TB0.5) ; port OSC_EN

Not connected (* = marked no-connect by the designer): J5 2 6 10 12 13 14; U10 15(P8.0) 16(P8.1) 17(P8.2) 48(P4.3/PM_UCB1CLK/PM_UCA1STE)

### Notes on the sheet
- POWER DECOUPLING
- MSP430F5529
- AVCC1
- DVCC1
- DVCC2
- (near U10) MSP4305529 CONNECTIONS
- (near J5) JTAG HEADER
- I2C PULLUPS
- TEST SWITCH
- OSCILLATORS
- TEST LEDS
- USB INTERFACE
- CONFIDENTAL. Do not distribute.
- Variant:
- Checked by
- (in symbol SDTitleBlock) Title:; Page Contents:; Revision:; Size:; DWG NO; Date:; Sheet; of

### Library data of the parts
C40 C65 = C1608C0G1H330J080AA: CAP CER 33PF 50V C0G 0603; Manufacturer: TDK Corporation; Tolerance: ±5%; Temperature Coefficient: C0G, NP0; Supplier 1: Digi-Key; Manufacturer Part Number: C1608C0G1H330J080AA; RoHS: RoHS Compliant; Category: Capacitors; Stock 1: 167556; Pricing 1: 1=0.1, 10=0.03, 100=0.0138, 250=0.01124, 500=0.00962, 1000=0.0075 (USD); Packaging: Cut Tape (CT); Voltage - Rated: 50V; Mounting Type: Surface Mount, MLCC; Operating Temperature: -55°C ~ 125°C; Applications: General Purpose; Ratings: -; Package / Case: 0603 (1608 Metric); Size / Dimension: 0.063" L x 0.031" W (1.60mm x 0.80mm); Height - Seated (Max): -; Thickness (Max): 0.037" (0.95mm); Lead Spacing: -; Features: -; Lead Style: -; ComponentLink1URL: https://product.tdk.com/info/en/catalog/datasheets/mlcc_commercial_general_en.pdf; ComponentLink1Description: https://product.tdk.com/info/en/catalog/datasheets/mlcc_commercial_general_en.pdf; Supplier Part Number 1: 445-1275-1-ND
C41 C42 = C1608C0G1H120J080AA: CAP CER 12PF 50V C0G 0603; Manufacturer: TDK Corporation; Tolerance: ±5%; Temperature Coefficient: C0G, NP0; Supplier 1: Digi-Key; Manufacturer Part Number: C1608C0G1H120J080AA; RoHS: RoHS Compliant; Category: Capacitors; Stock 1: 115030; Pricing 1: 1=0.1, 10=0.03, 100=0.0138, 250=0.01124, 500=0.00962, 1000=0.0075 (USD); Packaging: Cut Tape (CT); Voltage - Rated: 50V; Mounting Type: Surface Mount, MLCC; Operating Temperature: -55°C ~ 125°C; Applications: General Purpose; Ratings: -; Package / Case: 0603 (1608 Metric); Size / Dimension: 0.063" L x 0.031" W (1.60mm x 0.80mm); Height - Seated (Max): -; Thickness (Max): 0.037" (0.95mm); Lead Spacing: -; Features: -; Lead Style: -; ComponentLink1URL: https://product.tdk.com/info/en/catalog/datasheets/mlcc_commercial_general_en.pdf; ComponentLink1Description: https://product.tdk.com/info/en/catalog/datasheets/mlcc_commercial_general_en.pdf; Supplier Part Number 1: 445-1270-1-ND
C45 C48 C52 C58 = GRM21BR61E106KA73L: as C37 on sheet [04] - Connectors; Supplier 1: Digi-Key; Manufacturer Part Number: GRM21BR61E106KA73L; RoHS: RoHS Compliant; Category: Capacitors; Stock 1: 242003; Pricing 1: 1=0.2, 10=0.136, 50=0.0826, 100=0.0693 (USD); Packaging: Cut Tape (CT); Voltage - Rated: 25V; Temperature Coefficient: X5R; Mounting Type: Surface Mount, MLCC; Operating Temperature: -55°C ~ 85°C; Applications: General Purpose; Ratings: -; Package / Case: 0805 (2012 Metric); Size / Dimension: 0.079" L x 0.049" W (2.00mm x 1.25mm); Height - Seated (Max): -; Thickness (Max): 0.053" (1.35mm); Lead Spacing: -; Features: -; Lead Style: -; ComponentLink1URL: http://www.murata.com/~/media/webrenewal/support/library/catalog/products/capacitor/mlcc/c02e.pdf; ComponentLink1Description: http://www.murata.com/~/media/webrenewal/support/library/catalog/products/capacitor/mlcc/c02e.pdf; Supplier Part Number 1: 490-5523-1-ND
C47 C50 C51 C54 C59 C62 = GRM188R71C104KA01D: CAP CER 0.1UF 16V X7R 0603; Manufacturer: Murata Electronics North America; Tolerance: ±10%; Supplier 1: Digi-Key; Manufacturer Part Number: GRM188R71C104KA01D; RoHS: RoHS Compliant; Category: Capacitors; Stock 1: 3229528; Pricing 1: 1=0.1, 10=0.019, 50=0.0102, 100=0.0086, 250=0.00704, 500=0.006, 1000=0.00468 (USD); Packaging: Cut Tape (CT); Voltage - Rated: 16V; Temperature Coefficient: X7R; Mounting Type: Surface Mount, MLCC; Operating Temperature: -55°C ~ 125°C; Applications: General Purpose; Ratings: -; Package / Case: 0603 (1608 Metric); Size / Dimension: 0.063" L x 0.031" W (1.60mm x 0.80mm); Height - Seated (Max): -; Thickness (Max): 0.035" (0.90mm); Lead Spacing: -; Features: -; Lead Style: -; ComponentLink1URL: http://www.murata.com/~/media/webrenewal/support/library/catalog/products/capacitor/mlcc/c02e.pdf; ComponentLink1Description: http://www.murata.com/~/media/webrenewal/support/library/catalog/products/capacitor/mlcc/c02e.pdf; Supplier Part Number 1: 490-1532-1-ND
C55 C60 = GRM188R71C224KA01D: CAP CER 0.22UF 16V X7R 0603; Manufacturer: Murata Electronics North America; Tolerance: ±10%; Supplier 1: Digi-Key; Manufacturer Part Number: GRM188R71C224KA01D; RoHS: RoHS Compliant; Category: Capacitors; Stock 1: 226329; Pricing 1: 1=0.12, 10=0.084, 50=0.0456, 100=0.0387, 250=0.03164, 500=0.02706, 1000=0.02109 (USD); Packaging: Cut Tape (CT); Voltage - Rated: 16V; Temperature Coefficient: X7R; Mounting Type: Surface Mount, MLCC; Operating Temperature: -55°C ~ 125°C; Applications: General Purpose; Ratings: -; Package / Case: 0603 (1608 Metric); Size / Dimension: 0.063" L x 0.031" W (1.60mm x 0.80mm); Height - Seated (Max): -; Thickness (Max): 0.035" (0.90mm); Lead Spacing: -; Features: -; Lead Style: -; ComponentLink1URL: http://www.murata.com/~/media/webrenewal/support/library/catalog/products/capacitor/mlcc/c02e.pdf; ComponentLink1Description: http://www.murata.com/~/media/webrenewal/support/library/catalog/products/capacitor/mlcc/c02e.pdf; Supplier Part Number 1: 490-3293-1-ND
C56 = C1608X5R1C474K080AA: CAP CER 0.47UF 16V X5R 0603; Manufacturer: TDK Corporation; Tolerance: ±10%; Supplier 1: Digi-Key; Manufacturer Part Number: C1608X5R1C474K080AA; RoHS: RoHS Compliant; Category: Capacitors; Stock 1: 19350; Pricing 1: 1=0.1, 10=0.066, 100=0.0303, 250=0.02476, 500=0.02118, 1000=0.0165 (USD); Packaging: Cut Tape (CT); Voltage - Rated: 16V; Temperature Coefficient: X5R; Mounting Type: Surface Mount, MLCC; Operating Temperature: -55°C ~ 85°C; Applications: General Purpose; Ratings: -; Package / Case: 0603 (1608 Metric); Size / Dimension: 0.063" L x 0.031" W (1.60mm x 0.80mm); Height - Seated (Max): -; Thickness (Max): 0.037" (0.95mm); Lead Spacing: -; Features: -; Lead Style: -; ComponentLink1URL: https://product.tdk.com/info/en/catalog/datasheets/mlcc_commercial_general_en.pdf; ComponentLink1Description: https://product.tdk.com/info/en/catalog/datasheets/mlcc_commercial_general_en.pdf; Supplier Part Number 1: 445-5152-1-ND
C57 = GRM188R71C222KA01D: CAP CER 2200PF 16V X7R 0603; Manufacturer: Murata Electronics North America; Tolerance: ±10%; Supplier 1: Digi-Key; Manufacturer Part Number: GRM188R71C222KA01D; RoHS: RoHS Compliant; Category: Capacitors; Stock 1: 8206; Pricing 1: 1=0.1, 10=0.052, 50=0.028, 100=0.0237, 250=0.01936, 500=0.01656, 1000=0.0129 (USD); Packaging: Cut Tape (CT); Voltage - Rated: 16V; Temperature Coefficient: X7R; Mounting Type: Surface Mount, MLCC; Operating Temperature: -55°C ~ 125°C; Applications: General Purpose; Ratings: -; Package / Case: 0603 (1608 Metric); Size / Dimension: 0.063" L x 0.031" W (1.60mm x 0.80mm); Height - Seated (Max): -; Thickness (Max): 0.035" (0.90mm); Lead Spacing: -; Features: -; Lead Style: -; ComponentLink1URL: http://www.murata.com/~/media/webrenewal/support/library/catalog/products/capacitor/mlcc/c02e.pdf; ComponentLink1Description: http://www.murata.com/~/media/webrenewal/support/library/catalog/products/capacitor/mlcc/c02e.pdf; Supplier Part Number 1: 490-11512-1-ND
C61 = GRM188R60J475KE19D: CAP CER 4.7UF 6.3V X5R 0603; Manufacturer: Murata Electronics North America; Tolerance: ±10%; Supplier 1: Digi-Key; Manufacturer Part Number: GRM188R60J475KE19D; RoHS: RoHS Compliant; Category: Capacitors; Stock 1: 616874; Pricing 1: 1=0.12, 10=0.08, 50=0.046, 100=0.038, 250=0.032, 500=0.0268, 1000=0.022 (USD); Packaging: Cut Tape (CT); Voltage - Rated: 6.3V; Temperature Coefficient: X5R; Mounting Type: Surface Mount, MLCC; Operating Temperature: -55°C ~ 85°C; Applications: General Purpose; Ratings: -; Package / Case: 0603 (1608 Metric); Size / Dimension: 0.063" L x 0.031" W (1.60mm x 0.80mm); Height - Seated (Max): -; Thickness (Max): 0.035" (0.90mm); Lead Spacing: -; Features: -; Lead Style: -; ComponentLink1URL: http://www.murata.com/~/media/webrenewal/support/library/catalog/products/capacitor/mlcc/c02e.pdf; ComponentLink1Description: http://www.murata.com/~/media/webrenewal/support/library/catalog/products/capacitor/mlcc/c02e.pdf; Supplier Part Number 1: 490-3297-1-ND
C63 C64 = GRM1885C1H100JA01D: CAP CER 10PF 50V NP0 0603; Manufacturer: Murata Electronics North America; Tolerance: ±5%; Temperature Coefficient: C0G, NP0; Supplier 1: Digi-Key; Manufacturer Part Number: GRM1885C1H100JA01D; RoHS: RoHS Compliant; Category: Capacitors; Stock 1: 324240; Pricing 1: 1=0.1, 10=0.041, 50=0.0222, 100=0.0187, 250=0.01532, 500=0.0131, 1000=0.0102 (USD); Packaging: Cut Tape (CT); Voltage - Rated: 50V; Mounting Type: Surface Mount, MLCC; Operating Temperature: -55°C ~ 125°C; Applications: General Purpose; Ratings: -; Package / Case: 0603 (1608 Metric); Size / Dimension: 0.063" L x 0.031" W (1.60mm x 0.80mm); Height - Seated (Max): -; Thickness (Max): 0.035" (0.90mm); Lead Spacing: -; Features: -; Lead Style: -; ComponentLink1URL: http://www.murata.com/~/media/webrenewal/support/library/catalog/products/capacitor/mlcc/c02e.pdf; ComponentLink1Description: http://www.murata.com/~/media/webrenewal/support/library/catalog/products/capacitor/mlcc/c02e.pdf; Supplier Part Number 1: 490-1403-1-ND
D1 = LB Q39E-N1OO-35-1: LED BLUE DIFFUSED 0603 SMD; Manufacturer: OSRAM Opto Semiconductors Inc.; Lens Color: White; Millicandela Rating: 42mcd; Lens Style/Size: Rectangle with Flat Top, 1.10mm x 0.80mm; Voltage - Forward (Vf) (Typ): 2.85V; Current - Test: 5mA; Viewing Angle: 170°, 130°; Wavelength - Dominant: 470nm; Wavelength - Peak: 465nm; Supplier 1: Digi-Key; Manufacturer Part Number: LB Q39E-N1OO-35-1; RoHS: RoHS Compliant; Category: Optoelectronics; Stock 1: 38538; Pricing 1: 1=0.35, 10=0.268, 25=0.2184, 100=0.1736, 250=0.1488, 500=0.12896, 1000=0.0992 (USD); Packaging: Cut Tape (CT); Lens Transparency: Diffused; Mounting Type: Surface Mount; Features: -; Package / Case: 0603 (1608 Metric); Supplier Device Package: *; Size / Dimension: 1.60mm L x 0.80mm W; Height (Max): 0.40mm; ComponentLink1URL: http://www.osram-os.com/Graphics/XPic5/00124611_0.pdf; ComponentLink1Description: http://www.osram-os.com/Graphics/XPic5/00124611_0.pdf; Supplier Part Number 1: 475-2815-1-ND
D2 = SD103AWS-E3-08: DIODE SCHOTTKY 40V 350MA SOD323; Manufacturer: Vishay Semiconductor Diodes Division; Current - Average Rectified (Io): 350mA (DC); Voltage - Forward (Vf) (Max) @ If: 600mV @ 200mA; Speed: Fast Recovery =< 500ns, > 200mA (Io); Reverse Recovery Time (trr): 10ns; Current - Reverse Leakage @ Vr: 5µA @ 30V; Capacitance @ Vr, F: 50pF @ 0V, 1MHz; Supplier 1: Digi-Key; Manufacturer Part Number: SD103AWS-E3-08; RoHS: RoHS Compliant; Category: Discrete Semiconductor Products; Stock 1: 96191; Pricing 1: 1=0.38, 10=0.28, 100=0.1584, 500=0.10506, 1000=0.08058 (USD); Packaging: Cut Tape (CT); Diode Type: Schottky; Voltage - DC Reverse (Vr) (Max): 40V; Mounting Type: Surface Mount; Package / Case: SC-76, SOD-323; Supplier Device Package: SOD-323; Operating Temperature - Junction: -55°C ~ 125°C; ComponentLink1URL: http://www.vishay.com/docs/85682/sd103aws.pdf; ComponentLink1Description: http://www.vishay.com/docs/85682/sd103aws.pdf; Supplier Part Number 1: SD103AWS-E3-08GICT-ND
D3 = SMLE12WBC7W1: LED WHITE DIFFUSED 0603 SMD; Manufacturer: Rohm Semiconductor; Millicandela Rating: 71mcd; Lens Style/Size: Rectangle with Flat Top, 1.20mm x 0.80mm; Voltage - Forward (Vf) (Typ): 2.9V; Current - Test: 5mA; Supplier 1: Digi-Key; Manufacturer Part Number: SMLE12WBC7W1; RoHS: RoHS Compliant; Category: Optoelectronics; Stock 1: 29713; Pricing 1: 1=0.75, 10=0.578, 25=0.48, 100=0.4125, 250=0.36, 500=0.315, 1000=0.2475, 2500=0.225 (USD); Packaging: Cut Tape (CT); Lens Color: White; Lens Transparency: Diffused; Viewing Angle: -; Mounting Type: Surface Mount; Wavelength - Dominant: -; Wavelength - Peak: -; Features: -; Package / Case: 0603 (1608 Metric); Supplier Device Package: 0603 (1608 Metric); Size / Dimension: 1.60mm L x 0.80mm W; Height (Max): 0.46mm; ComponentLink1URL: http://rohmfs.rohm.com/en/products/databook/datasheet/opto/led/chip_mono/sml-e1.pdf; ComponentLink1Description: http://rohmfs.rohm.com/en/products/databook/datasheet/opto/led/chip_mono/sml-e1.pdf; Supplier Part Number 1: 511-1602-1-ND
D4 = SML-D12M8WT86: LED GREEN DIFFUSED 0603 SMD; Manufacturer: Rohm Semiconductor; Lens Color: White; Millicandela Rating: 25mcd; Lens Style/Size: Rectangle with Flat Top, 1.20mm x 0.80mm; Voltage - Forward (Vf) (Typ): 2.2V; Current - Test: 20mA; Wavelength - Dominant: 572nm; Supplier 1: Digi-Key; Manufacturer Part Number: SML-D12M8WT86; RoHS: RoHS Compliant; Category: Optoelectronics; Stock 1: 36910; Pricing 1: 1=0.34, 10=0.264, 25=0.228, 100=0.144, 250=0.096, 500=0.0816, 1000=0.0624 (USD); Packaging: Cut Tape (CT); Lens Transparency: Diffused; Viewing Angle: -; Mounting Type: Surface Mount; Wavelength - Peak: -; Features: -; Package / Case: 0603 (1608 Metric); Supplier Device Package: 0603 (1608 Metric); Size / Dimension: 1.60mm L x 0.80mm W; Height (Max): 0.65mm; ComponentLink1URL: http://rohmfs.rohm.com/en/products/databook/datasheet/opto/led/chip_mono/sml-d1.pdf; ComponentLink1Description: http://rohmfs.rohm.com/en/products/databook/datasheet/opto/led/chip_mono/sml-d1.pdf; Supplier Part Number 1: 511-1578-1-ND
D5 = SML-D12U8WT86: LED RED DIFFUSED 0603 SMD; Manufacturer: Rohm Semiconductor; Lens Color: White; Millicandela Rating: 63mcd; Lens Style/Size: Rectangle with Flat Top, 1.20mm x 0.80mm; Voltage - Forward (Vf) (Typ): 2.2V; Current - Test: 20mA; Wavelength - Dominant: 620nm; Supplier 1: Digi-Key; Manufacturer Part Number: SML-D12U8WT86; RoHS: RoHS Compliant; Category: Optoelectronics; Stock 1: 13583; Pricing 1: 1=0.34, 10=0.264, 25=0.228, 100=0.144, 250=0.096, 500=0.0816, 1000=0.0624 (USD); Packaging: Cut Tape (CT); Lens Transparency: Diffused; Viewing Angle: -; Mounting Type: Surface Mount; Wavelength - Peak: -; Features: -; Package / Case: 0603 (1608 Metric); Supplier Device Package: 0603 (1608 Metric); Size / Dimension: 1.60mm L x 0.80mm W; Height (Max): 0.65mm; ComponentLink1URL: http://rohmfs.rohm.com/en/products/databook/datasheet/opto/led/chip_mono/sml-d1.pdf; ComponentLink1Description: http://rohmfs.rohm.com/en/products/databook/datasheet/opto/led/chip_mono/sml-d1.pdf; Supplier Part Number 1: 511-1580-1-ND
J5 = 2514-6002UB: SHROUDED HEADER 14 POS STRAIGHT; Manufacturer: 3M; Connector Type: Header, Shrouded; Number of Positions: 14; Number of Positions Loaded: All; Pitch: 0.100" (2.54mm); Supplier 1: Digi-Key; Manufacturer Part Number: 2514-6002UB; RoHS: RoHS non-compliant; Category: Connectors, Interconnects; Stock 1: 426; Pricing 1: 1=2.75, 10=2.64, 50=2.31, 100=2.2, 250=1.925, 500=1.87, 1000=1.595, 2500=1.485, 5000=1.43 (USD); Packaging: Bulk; Contact Type: Male Pin; Number of Rows: 2; Row Spacing: 0.100" (2.54mm); Contact Mating Length: 0.243" (6.17mm); Mounting Type: Through Hole; Termination: Solder; Fastening Type: -; Features: -; Contact Finish: Gold; Contact Finish Thickness: 30µin (0.76µm); Color: Black; ComponentLink1URL: http://multimedia.3m.com/mws/mediawebserver?66666UuZjcFSLXTtMXM6MxfcEVuQEcuZgVs6EVs6E666666--; ComponentLink1Description: http://multimedia.3m.com/mws/mediawebserver?66666UuZjcFSLXTtMXM6MxfcEVuQEcuZgVs6EVs6E666666--; Supplier Part Number 1: MHB14K-ND
J6 = ZX62-B-5PA(11): CONN RCPT MICRO USB B SMD R/A; Manufacturer: Hirose Electric Co Ltd; Connector Type: USB - micro B; Number of Contacts: 5; Gender: Receptacle; Specifications: USB 2.0; Supplier 1: Digi-Key; Manufacturer Part Number: ZX62-B-5PA(11); RoHS: RoHS Compliant; Category: Connectors, Interconnects; Stock 1: 33955; Pricing 1: 1=0.96, 10=0.842, 25=0.792, 50=0.759, 100=0.726, 250=0.66, 500=0.594, 1000=0.528 (USD); Packaging: Cut Tape (CT); Mounting Type: Surface Mount, Right Angle, Horizontal; Features: -; Ingress Protection: -; ComponentLink1URL: http://www.hirose.co.jp/cataloge_hp/ed_ZX_20140804.pdf; ComponentLink1Description: http://www.hirose.co.jp/cataloge_hp/ed_ZX_20140804.pdf; Supplier Part Number 1: H11634CT-ND
R3 R25 = ERJ-3EKF4702V: RES SMD 47K OHM 1% 1/10W 0603; Power (Watts): 0.1W, 1/10W; Temperature Coefficient: ±100ppm/°C; Supplier 1: Digi-Key; Manufacturer: Panasonic Electronic Components; Manufacturer Part Number: ERJ-3EKF4702V; RoHS: RoHS Compliant; Category: Resistors; Stock 1: 4854478; Pricing 1: 1=0.1, 50=0.0114, 100=0.0084, 250=0.00644, 500=0.00514, 1000=0.00379 (USD); Packaging: Cut Tape (CT); Tolerance: ±1%; Composition: Thick Film; Features: Automotive AEC-Q200; Operating Temperature: -55°C ~ 155°C; Package / Case: 0603 (1608 Metric); Supplier Device Package: 0603; Size / Dimension: 0.063" L x 0.031" W (1.60mm x 0.80mm); Height: 0.022" (0.55mm); Number of Terminations: 2; ComponentLink1URL: http://industrial.panasonic.com/www-cgi/jvcr13pz.cgi?E+PZ+3+AOA0002+ERJ3EKF4702V+7+WW; ComponentLink1Description: http://industrial.panasonic.com/www-cgi/jvcr13pz.cgi?E+PZ+3+AOA0002+ERJ3EKF4702V+7+WW; Supplier Part Number 1: P47.0KHCT-ND
R4 R7 R8 R27 = ERJ-3EKF4700V: RES SMD 470 OHM 1% 1/10W 0603; Manufacturer: Panasonic Electronic Components; Power (Watts): 0.1W, 1/10W; Temperature Coefficient: ±100ppm/°C; Supplier 1: Digi-Key; Manufacturer Part Number: ERJ-3EKF4700V; RoHS: RoHS Compliant; Category: Resistors; Stock 1: 272591; Pricing 1: 1=0.1, 50=0.0114, 100=0.0084, 250=0.00644, 500=0.00514, 1000=0.00379 (USD); Packaging: Cut Tape (CT); Tolerance: ±1%; Composition: Thick Film; Features: Automotive AEC-Q200; Operating Temperature: -55°C ~ 155°C; Package / Case: 0603 (1608 Metric); Supplier Device Package: 0603; Size / Dimension: 0.063" L x 0.031" W (1.60mm x 0.80mm); Height: 0.022" (0.55mm); Number of Terminations: 2; ComponentLink1URL: http://industrial.panasonic.com/www-cgi/jvcr13pz.cgi?E+PZ+3+AOA0002+ERJ3EKF4700V+7+WW; ComponentLink1Description: http://industrial.panasonic.com/www-cgi/jvcr13pz.cgi?E+PZ+3+AOA0002+ERJ3EKF4700V+7+WW; Supplier Part Number 1: P470HCT-ND
R20-R23 = ERJ-3EKF4701V: RES SMD 4.7K OHM 1% 1/10W 0603; Manufacturer: Panasonic Electronic Components; Power (Watts): 0.1W, 1/10W; Temperature Coefficient: ±100ppm/°C; Supplier 1: Digi-Key; Manufacturer Part Number: ERJ-3EKF4701V; RoHS: RoHS Compliant; Category: Resistors; Stock 1: 3227786; Pricing 1: 1=0.1, 50=0.0114, 100=0.0084, 250=0.00644, 500=0.00514, 1000=0.00379 (USD); Packaging: Cut Tape (CT); Tolerance: ±1%; Composition: Thick Film; Features: Automotive AEC-Q200; Operating Temperature: -55°C ~ 155°C; Package / Case: 0603 (1608 Metric); Supplier Device Package: 0603; Size / Dimension: 0.063" L x 0.031" W (1.60mm x 0.80mm); Height: 0.022" (0.55mm); Number of Terminations: 2; ComponentLink1URL: http://industrial.panasonic.com/www-cgi/jvcr13pz.cgi?E+PZ+3+AOA0002+ERJ3EKF4701V+7+WW; ComponentLink1Description: http://industrial.panasonic.com/www-cgi/jvcr13pz.cgi?E+PZ+3+AOA0002+ERJ3EKF4701V+7+WW; Supplier Part Number 1: P4.70KHCT-ND
R24 R26 R28 = ERJ-3GEY0R00V: as R16 on sheet [04] - Connectors; Supplier 1: Digi-Key; Manufacturer Part Number: ERJ-3GEY0R00V; RoHS: RoHS Compliant; Category: Resistors; Stock 1: 7608993; Pricing 1: 1=0.1, 50=0.0126, 100=0.0096, 250=0.00716, 500=0.00528, 1000=0.00352, 2500=0.00297 (USD); Packaging: Cut Tape (CT); Tolerance: Jumper; Composition: Thick Film; Features: Automotive AEC-Q200; Temperature Coefficient: -; Operating Temperature: -55°C ~ 155°C; Package / Case: 0603 (1608 Metric); Supplier Device Package: 0603; Size / Dimension: 0.063" L x 0.031" W (1.60mm x 0.80mm); Height: 0.022" (0.55mm); Number of Terminations: 2; ComponentLink1URL: http://industrial.panasonic.com/www-cgi/jvcr13pz.cgi?E+PZ+3+AOA0001+ERJ3GEY0R00V+7+WW; ComponentLink1Description: http://industrial.panasonic.com/www-cgi/jvcr13pz.cgi?E+PZ+3+AOA0001+ERJ3GEY0R00V+7+WW; Supplier Part Number 1: P0.0GCT-ND
R29 = ERJ-3EKF1000V: RES SMD 100 OHM 1% 1/10W 0603; Manufacturer: Panasonic Electronic Components; Power (Watts): 0.1W, 1/10W; Temperature Coefficient: ±100ppm/°C; Supplier 1: Digi-Key; Manufacturer Part Number: ERJ-3EKF1000V; RoHS: RoHS Compliant; Category: Resistors; Stock 1: 1209679; Pricing 1: 1=0.1, 50=0.0114, 100=0.0084, 250=0.00644, 500=0.00514, 1000=0.00379 (USD); Packaging: Cut Tape (CT); Tolerance: ±1%; Composition: Thick Film; Features: Automotive AEC-Q200; Operating Temperature: -55°C ~ 155°C; Package / Case: 0603 (1608 Metric); Supplier Device Package: 0603; Size / Dimension: 0.063" L x 0.031" W (1.60mm x 0.80mm); Height: 0.022" (0.55mm); Number of Terminations: 2; ComponentLink1URL: http://industrial.panasonic.com/www-cgi/jvcr13pz.cgi?E+PZ+3+AOA0002+ERJ3EKF1000V+7+WW; ComponentLink1Description: http://industrial.panasonic.com/www-cgi/jvcr13pz.cgi?E+PZ+3+AOA0002+ERJ3EKF1000V+7+WW; Supplier Part Number 1: P100HCT-ND
R30 R32 = ERJ-3EKF27R0V: RES SMD 27 OHM 1% 1/10W 0603; Manufacturer: Panasonic Electronic Components; Power (Watts): 0.1W, 1/10W; Temperature Coefficient: ±100ppm/°C; Supplier 1: Digi-Key; Manufacturer Part Number: ERJ-3EKF27R0V; RoHS: RoHS Compliant; Category: Resistors; Stock 1: 549098; Pricing 1: 1=0.1, 50=0.0114, 100=0.0084, 250=0.00644, 500=0.00514, 1000=0.00379 (USD); Packaging: Cut Tape (CT); Tolerance: ±1%; Composition: Thick Film; Features: Automotive AEC-Q200; Operating Temperature: -55°C ~ 155°C; Package / Case: 0603 (1608 Metric); Supplier Device Package: 0603; Size / Dimension: 0.063" L x 0.031" W (1.60mm x 0.80mm); Height: 0.022" (0.55mm); Number of Terminations: 2; ComponentLink1URL: http://industrial.panasonic.com/www-cgi/jvcr13pz.cgi?E+PZ+3+AOA0002+ERJ3EKF27R0V+7+WW; ComponentLink1Description: http://industrial.panasonic.com/www-cgi/jvcr13pz.cgi?E+PZ+3+AOA0002+ERJ3EKF27R0V+7+WW; Supplier Part Number 1: P27.0HCT-ND
R31 = ERJ-3EKF1401V: RES SMD 1.4K OHM 1% 1/10W 0603; Manufacturer: Panasonic Electronic Components; Power (Watts): 0.1W, 1/10W; Temperature Coefficient: ±100ppm/°C; Supplier 1: Digi-Key; Manufacturer Part Number: ERJ-3EKF1401V; RoHS: RoHS Compliant; Category: Resistors; Stock 1: 47498; Pricing 1: 1=0.1, 50=0.0114, 100=0.0084, 250=0.00644, 500=0.00514, 1000=0.00379 (USD); Packaging: Cut Tape (CT); Tolerance: ±1%; Composition: Thick Film; Features: Automotive AEC-Q200; Operating Temperature: -55°C ~ 155°C; Package / Case: 0603 (1608 Metric); Supplier Device Package: 0603; Size / Dimension: 0.063" L x 0.031" W (1.60mm x 0.80mm); Height: 0.022" (0.55mm); Number of Terminations: 2; ComponentLink1URL: http://industrial.panasonic.com/www-cgi/jvcr13pz.cgi?E+PZ+3+AOA0002+ERJ3EKF1401V+7+WW; ComponentLink1Description: http://industrial.panasonic.com/www-cgi/jvcr13pz.cgi?E+PZ+3+AOA0002+ERJ3EKF1401V+7+WW; Supplier Part Number 1: P1.40KHCT-ND
R33 = ERJ-3EKF1004V: RES SMD 1M OHM 1% 1/10W 0603; Manufacturer: Panasonic Electronic Components; Power (Watts): 0.1W, 1/10W; Temperature Coefficient: ±100ppm/°C; Supplier 1: Digi-Key; Manufacturer Part Number: ERJ-3EKF1004V; RoHS: RoHS Compliant; Category: Resistors; Stock 1: 1138673; Pricing 1: 1=0.1, 50=0.0114, 100=0.0084, 250=0.00644, 500=0.00514, 1000=0.00379 (USD); Packaging: Cut Tape (CT); Tolerance: ±1%; Composition: Thick Film; Features: Automotive AEC-Q200; Operating Temperature: -55°C ~ 155°C; Package / Case: 0603 (1608 Metric); Supplier Device Package: 0603; Size / Dimension: 0.063" L x 0.031" W (1.60mm x 0.80mm); Height: 0.022" (0.55mm); Number of Terminations: 2; ComponentLink1URL: http://industrial.panasonic.com/www-cgi/jvcr13pz.cgi?E+PZ+3+AOA0002+ERJ3EKF1004V+7+WW; ComponentLink1Description: http://industrial.panasonic.com/www-cgi/jvcr13pz.cgi?E+PZ+3+AOA0002+ERJ3EKF1004V+7+WW; Supplier Part Number 1: P1.00MHCT-ND
SW1-SW3 = PTS645SH50SMTR92 LFS: SWITCH TACTILE SPST-NO 0.05A 12V; Manufacturer: C&K Components; Switch Function: Off-Mom; Contact Rating @ Voltage: 0.05A @ 12VDC; Actuator Type: Standard; Actuator Height off PCB, from Pins: 5.00mm; Actuator Orientation: Top Actuated; Outline: 6.00mm x 6.00mm; Illumination: Non-Illuminated; Operating Force: 200gf; Actuator Material: Polyamide (PA66), Nylon 6/6; Mechanical Life: 100,000 Cycles; Supplier 1: Digi-Key; Manufacturer Part Number: PTS645SH50SMTR92 LFS; RoHS: RoHS Compliant; Category: Switches; Stock 1: 51045; Pricing 1: 1=0.29, 10=0.283, 25=0.2732, 50=0.2632, 100=0.253, 250=0.23276, 500=0.2024 (USD); Packaging: Cut Tape (CT); Circuit: SPST-NO; Mounting Type: Surface Mount; Termination Style: Gull Wing; Illumination Voltage (Nominal): -; Illumination Type, Color: -; Ingress Protection: -; Features: -; Switch Travel: -; Operating Temperature: -20°C ~ 60°C; ComponentLink1URL: http://www.ck-components.com/14409/pts645_7jan16.pdf/; ComponentLink1Description: http://www.ck-components.com/14409/pts645_7jan16.pdf/; Supplier Part Number 1: CKN9085CT-ND
U10 = MSP430F5529IPNR: IC MCU 16BIT 128KB FLASH 80LQFP; Manufacturer: Texas Instruments; Core Processor: CPUXV2; Core Size: 16-Bit; Speed: 25MHz; Connectivity: I²C, IrDA, LIN, SCI, SPI, UART/USART, USB; Peripherals: Brown-out Detect/Reset, DMA, POR, PWM, WDT; Number of I/O: 63; Program Memory Size: 128KB (128K x 8); RAM Size: 10K x 8; Voltage - Supply (Vcc/Vdd): 1.8 V ~ 3.6 V; Data Converters: A/D 16x12b; Oscillator Type: Internal; Supplier 1: Digi-Key; Manufacturer Part Number: MSP430F5529IPNR; RoHS: RoHS Compliant; Category: Integrated Circuits (ICs); Stock 1: 619; Pricing 1: 1=7.89, 10=7.153, 100=5.8963, 500=5.1552, 1000=4.0275 (USD); Packaging: Cut Tape (CT); Program Memory Type: FLASH; EEPROM Size: -; Operating Temperature: -40°C ~ 85°C (TA); Package / Case: 80-LQFP; Supplier Device Package: 80-LQFP (12x12); ComponentLink1URL: http://www.ti.com/lit/ds/symlink/msp430f5529.pdf; ComponentLink1Description: http://www.ti.com/lit/ds/symlink/msp430f5529.pdf; Supplier Part Number 1: 296-27306-1-ND
U11 = TPD2E001DRLRG4: TVS DIODE 5.5VWM 100VC SOT5; Manufacturer: Texas Instruments; Bidirectional Channels: 2; Voltage - Reverse Standoff (Typ): 5.5V (Max); Voltage - Breakdown (Min): 11V; Power Line Protection: Yes; Supplier 1: Digi-Key; Manufacturer Part Number: TPD2E001DRLRG4; RoHS: RoHS Compliant; Category: Circuit Protection; Stock 1: 6734; Pricing 1: 1=0.58, 10=0.495, 100=0.3699, 500=0.29056, 1000=0.224 (USD); Packaging: Cut Tape (CT); Type: Steering (Rail to Rail); Unidirectional Channels: -; Voltage - Clamping (Max) @ Ipp: -; Current - Peak Pulse (10/1000µs): -; Power - Peak Pulse: -; Applications: Ethernet; Capacitance @ Frequency: -; Operating Temperature: -40°C ~ 85°C (TA); Mounting Type: Surface Mount; Package / Case: SOT-553; Supplier Device Package: 5-SOT; ComponentLink1URL: http://www.ti.com/lit/ds/symlink/tpd2e001.pdf; ComponentLink1Description: http://www.ti.com/lit/ds/symlink/tpd2e001.pdf; Supplier Part Number 1: 296-35960-1-ND
X1 = ECS-120-20-30B-TR: CRYSTAL 12.0000MHZ 20PF SMD; Manufacturer: ECS Inc.; Frequency Stability: ±50ppm; Frequency Tolerance: ±30ppm; ESR (Equivalent Series Resistance): 80 Ohm; Operating Mode: Fundamental; Supplier 1: Digi-Key; Manufacturer Part Number: ECS-120-20-30B-TR; RoHS: RoHS Compliant; Category: Crystals and Oscillators; Stock 1: 6667; Pricing 1: 1=2.21, 10=1.918, 50=1.6816, 100=1.3275, 500=1.121 (USD); Packaging: Cut Tape (CT); Type: MHz Crystal; Frequency: 12MHz; Load Capacitance: 20pF; Operating Temperature: -20°C ~ 70°C; Ratings: -; Mounting Type: Surface Mount; Package / Case: 4-SMD, No Lead (DFN, LCC); Size / Dimension: 0.197" L x 0.126" W (5.00mm x 3.20mm); Height: 0.033" (0.85mm); ComponentLink1URL: http://www.ecsxtal.com/store/pdf/ecx_53b.pdf; ComponentLink1Description: http://www.ecsxtal.com/store/pdf/ecx_53b.pdf
X2 = ABS07-32.768KHZ-9-T: CRYSTAL 32.7680KHZ 9PF SMD; Manufacturer: Abracon LLC; Frequency Tolerance: ±20ppm; ESR (Equivalent Series Resistance): 70 kOhm; Operating Mode: Fundamental; Supplier 1: Digi-Key; Manufacturer Part Number: ABS07-32.768KHZ-9-T; RoHS: RoHS Compliant; Category: Crystals and Oscillators; Stock 1: 74773; Pricing 1: 1=0.77, 10=0.644, 50=0.5782, 100=0.5145, 500=0.49, 1000=0.4116 (USD); Packaging: Cut Tape (CT); Type: kHz Crystal (Tuning Fork); Frequency: 32.768kHz; Frequency Stability: -; Load Capacitance: 9pF; Operating Temperature: -40°C ~ 85°C; Ratings: -; Mounting Type: Surface Mount; Package / Case: 2-SMD; Size / Dimension: 0.126" L x 0.059" W (3.20mm x 1.50mm); Height: 0.035" (0.90mm); ComponentLink1URL: http://www.abracon.com/Resonators/ABS07.pdf; ComponentLink1Description: http://www.abracon.com/Resonators/ABS07.pdf; Supplier Part Number 1: 535-9544-1-ND

## Nets that join several sheets
GND: [04] - Connectors (67 pins), [05] - MSP430F5529 (42 pins)
VCC3V3: [04] - Connectors (8 pins), [05] - MSP430F5529 (15 pins)
P1.1: [04] - Connectors (J4.H2), [05] - MSP430F5529 (U10.22)
P1.2: [04] - Connectors (J4.H4), [05] - MSP430F5529 (U10.23)
P1.3: [04] - Connectors (J4.G6), [05] - MSP430F5529 (U10.24)
P1.4: [04] - Connectors (J4.G7), [05] - MSP430F5529 (U10.25)
P1.5: [04] - Connectors (J4.H19), [05] - MSP430F5529 (U10.26)
P1.6: [04] - Connectors (J4.H20), [05] - MSP430F5529 (U10.27)
P1.7: [04] - Connectors (J4.G18), [05] - MSP430F5529 (U10.28)
SIOC_1: [04] - Connectors (R16.1), [05] - MSP430F5529 (R20.1 U10.38)
SIOC_2: [04] - Connectors (R17.1), [05] - MSP430F5529 (R23.1 U10.47)
SIOD_1: [04] - Connectors (R18.1), [05] - MSP430F5529 (R21.1 U10.37)
SIOD_2: [04] - Connectors (R19.1), [05] - MSP430F5529 (R22.1 U10.46)
UCA0RXD: [04] - Connectors (J4.G21), [05] - MSP430F5529 (U10.41)
UCA0TXD: [04] - Connectors (J4.G22), [05] - MSP430F5529 (U10.40)
UCA1RXD: [04] - Connectors (J4.G34), [05] - MSP430F5529 (U10.52)
UCA1TXD: [04] - Connectors (J4.G33), [05] - MSP430F5529 (U10.51)
XCLK_1: [04] - Connectors (J4.G2), [05] - MSP430F5529 (U10.21)
XCLK_2: [04] - Connectors (J4.D20), [05] - MSP430F5529 (U10.31)
XCLK_3: [04] - Connectors (J4.G37), [05] - MSP430F5529 (U10.60)